# Altium schematic sheet Peripherals.SchDoc
size A4; MPS_Contact: www.monolithicpower.com
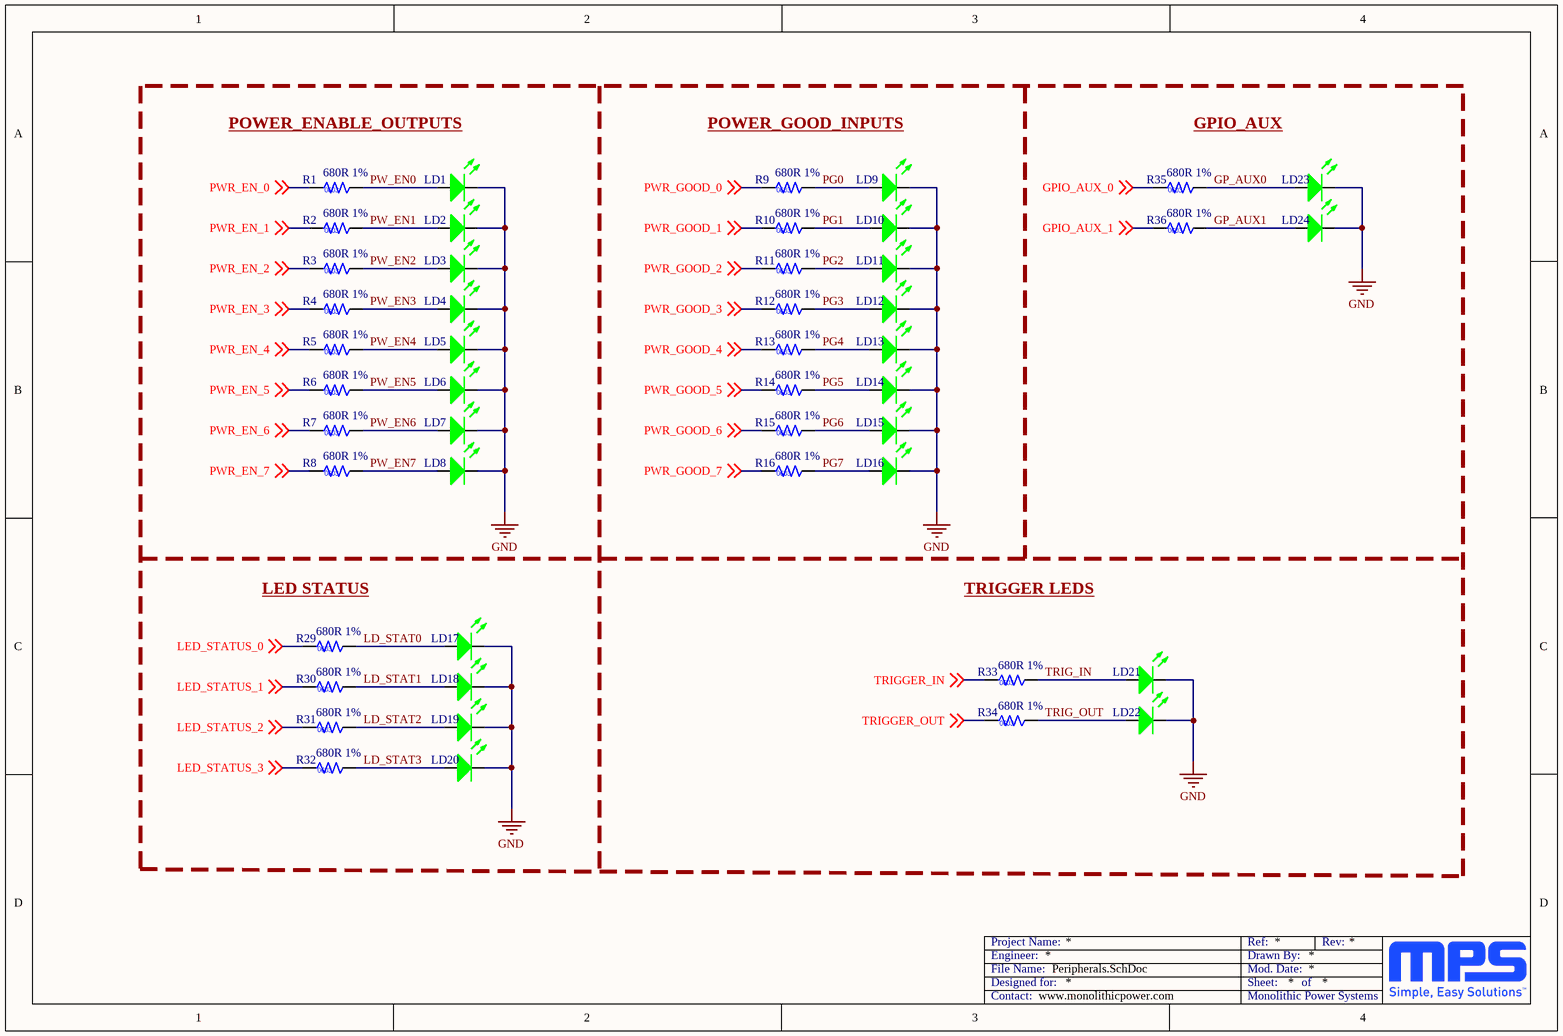
[diagram p0: Peripherals.SchDoc]

## Parts
LD1  APHD1608LCGCK  [LED/0603/GREEN]  (value not drawn)
LD2  APHD1608LCGCK  [LED/0603/GREEN]  (value not drawn)
LD3  APHD1608LCGCK  [LED/0603/GREEN]  (value not drawn)
LD4  APHD1608LCGCK  [LED/0603/GREEN]  (value not drawn)
LD5  APHD1608LCGCK  [LED/0603/GREEN]  (value not drawn)
LD6  APHD1608LCGCK  [LED/0603/GREEN]  (value not drawn)
LD7  APHD1608LCGCK  [LED/0603/GREEN]  (value not drawn)
LD8  APHD1608LCGCK  [LED/0603/GREEN]  (value not drawn)
LD9  APHD1608LCGCK  [LED/0603/GREEN]  (value not drawn)
LD10  APHD1608LCGCK  [LED/0603/GREEN]  (value not drawn)
LD11  APHD1608LCGCK  [LED/0603/GREEN]  (value not drawn)
LD12  APHD1608LCGCK  [LED/0603/GREEN]  (value not drawn)
LD13  APHD1608LCGCK  [LED/0603/GREEN]  (value not drawn)
LD14  APHD1608LCGCK  [LED/0603/GREEN]  (value not drawn)
LD15  APHD1608LCGCK  [LED/0603/GREEN]  (value not drawn)
LD16  APHD1608LCGCK  [LED/0603/GREEN]  (value not drawn)
LD17  APHD1608LCGCK  [LED/0603/GREEN]  (value not drawn)
LD18  APHD1608LCGCK  [LED/0603/GREEN]  (value not drawn)
LD19  APHD1608LCGCK  [LED/0603/GREEN]  (value not drawn)
LD20  APHD1608LCGCK  [LED/0603/GREEN]  (value not drawn)
LD21  APHD1608LCGCK  [LED/0603/GREEN]  (value not drawn)
LD22  APHD1608LCGCK  [LED/0603/GREEN]  (value not drawn)
LD23  APHD1608LCGCK  [LED/0603/GREEN]  (value not drawn)
LD24  APHD1608LCGCK  [LED/0603/GREEN]  (value not drawn)
R1  680R 1%  [CC/NM 0603]
R2  680R 1%  [CC/NM 0603]
R3  680R 1%  [CC/NM 0603]
R4  680R 1%  [CC/NM 0603]
R5  680R 1%  [CC/NM 0603]
R6  680R 1%  [CC/NM 0603]
R7  680R 1%  [CC/NM 0603]
R8  680R 1%  [CC/NM 0603]
R9  680R 1%  [CC/NM 0603]
R10  680R 1%  [CC/NM 0603]
R11  680R 1%  [CC/NM 0603]
R12  680R 1%  [CC/NM 0603]
R13  680R 1%  [CC/NM 0603]
R14  680R 1%  [CC/NM 0603]
R15  680R 1%  [CC/NM 0603]
R16  680R 1%  [CC/NM 0603]
R29  680R 1%  [CC/NM 0603]
R30  680R 1%  [CC/NM 0603]
R31  680R 1%  [CC/NM 0603]
R32  680R 1%  [CC/NM 0603]
R33  680R 1%  [CC/NM 0603]
R34  680R 1%  [CC/NM 0603]
R35  680R 1%  [CC/NM 0603]
R36  680R 1%  [CC/NM 0603]

## Nets
GND: LD1.2(K) LD2.2(K) LD3.2(K) LD4.2(K) LD5.2(K) LD6.2(K) LD7.2(K) LD8.2(K) LD9.2(K) LD10.2(K) LD11.2(K) LD12.2(K) LD13.2(K) LD14.2(K) LD15.2(K) LD16.2(K) LD17.2(K) LD18.2(K) LD19.2(K) LD20.2(K) LD21.2(K) LD22.2(K) LD23.2(K) LD24.2(K)
GP_AUX0: LD23.1(A) R35.2
GP_AUX1: LD24.1(A) R36.2
GPIO_AUX_0: R35.1 ; off-sheet GPIO_AUX_0
GPIO_AUX_1: R36.1 ; off-sheet GPIO_AUX_1
LD_STAT0: LD17.1(A) R29.2
LD_STAT1: LD18.1(A) R30.2
LD_STAT2: LD19.1(A) R31.2
LD_STAT3: LD20.1(A) R32.2
LED_STATUS_0: R29.1 ; off-sheet LED_STATUS_0
LED_STATUS_1: R30.1 ; off-sheet LED_STATUS_1
LED_STATUS_2: R31.1 ; off-sheet LED_STATUS_2
LED_STATUS_3: R32.1 ; off-sheet LED_STATUS_3
PG0: LD9.1(A) R9.2
PG1: LD10.1(A) R10.2
PG2: LD11.1(A) R11.2
PG3: LD12.1(A) R12.2
PG4: LD13.1(A) R13.2
PG5: LD14.1(A) R14.2
PG6: LD15.1(A) R15.2
PG7: LD16.1(A) R16.2
PW_EN0: LD1.1(A) R1.2
PW_EN1: LD2.1(A) R2.2
PW_EN2: LD3.1(A) R3.2
PW_EN3: LD4.1(A) R4.2
PW_EN4: LD5.1(A) R5.2
PW_EN5: LD6.1(A) R6.2
PW_EN6: LD7.1(A) R7.2
PW_EN7: LD8.1(A) R8.2
PWR_EN_0: R1.1 ; off-sheet PWR_EN_0
PWR_EN_1: R2.1 ; off-sheet PWR_EN_1
PWR_EN_2: R3.1 ; off-sheet PWR_EN_2
PWR_EN_3: R4.1 ; off-sheet PWR_EN_3
PWR_EN_4: R5.1 ; off-sheet PWR_EN_4
PWR_EN_5: R6.1 ; off-sheet PWR_EN_5
PWR_EN_6: R7.1 ; off-sheet PWR_EN_6
PWR_EN_7: R8.1 ; off-sheet PWR_EN_7
PWR_GOOD_0: R9.1 ; off-sheet PWR_GOOD_0
PWR_GOOD_1: R10.1 ; off-sheet PWR_GOOD_1
PWR_GOOD_2: R11.1 ; off-sheet PWR_GOOD_2
PWR_GOOD_3: R12.1 ; off-sheet PWR_GOOD_3
PWR_GOOD_4: R13.1 ; off-sheet PWR_GOOD_4
PWR_GOOD_5: R14.1 ; off-sheet PWR_GOOD_5
PWR_GOOD_6: R15.1 ; off-sheet PWR_GOOD_6
PWR_GOOD_7: R16.1 ; off-sheet PWR_GOOD_7
TRIG_IN: LD21.1(A) R33.2
TRIG_OUT: LD22.1(A) R34.2
TRIGGER_IN: R33.1 ; off-sheet TRIGGER_IN
TRIGGER_OUT: R34.1 ; off-sheet TRIGGER_OUT

## Notes on the sheet
- POWER_ENABLE_OUTPUTS
- POWER_GOOD_INPUTS
- GPIO_AUX
- (near R29) LED STATUS
- TRIGGER LEDS
- Engineer:
- Designed for:
- File Name:
- Project Name:
- Mod. Date:
- Sheet:
- Drawn By:
- Ref:
- of
- Rev:
- Contact:
- Monolithic Power Systems

## Library data of the parts
LD1-LD24 = APHD1608LCGCK: Green Light Emitting Diode; Manufacturer: Kingbright; DrownBy: Xavier Rocher; Datasheet: https://www.kingbrightusa.com/images/catalog/SPEC/APHD1608LCGCK.pdf; Package: 0603; Supplier 1: Digikey; Supplier  Part Number 1: 754-2031-2-ND; Supplier 2: Mouser; Supplier  Part Number 2: 604-APHD1608LCGCK; Manufacturer Part Number: APHD1608LCGCK; Automotive: No; Value: APHD1608LCGCK
R1-R16 R29-R36 = CR0603-FX-6800ELF: Resistores de película gruesa - SMD 680 ohm 1%; Manufacturer: BOURNS; DrownBy: Xavier Rocher; Datasheet: https://eu.mouser.com/datasheet/3/40/1/cr.pdf; Package: 0603; Supplier 1: Farnell; Supplier  Part Number 1: 4014380; Supplier 2: Mouser; Supplier  Part Number 2: 652-CR0603FX-6800ELF; Manufacturer Part Number: CR0603-FX-6800ELF; Automotive: No; Value: 680R 1%